# Altium schematic sheet DC_BOOST_PART.SchDoc
size A4
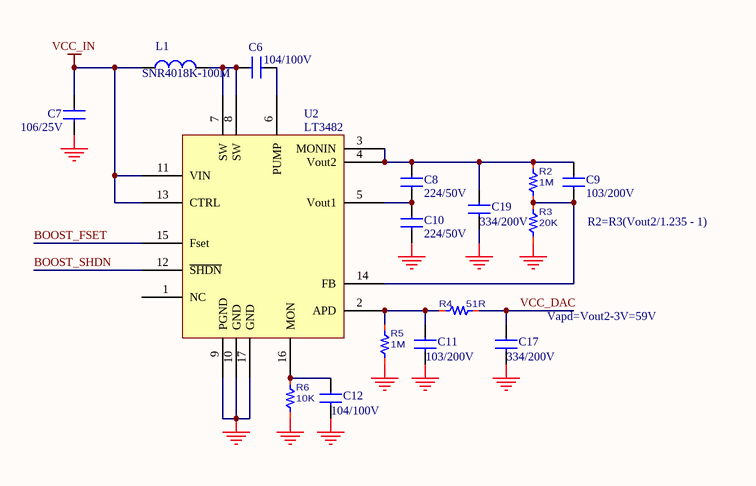
[diagram p0: DC_BOOST_PART.SchDoc]

## Parts
C6  104/100V  [0603C/1]
C7  106/25V  [0603C/1]
C8  224/50V  [0603C/1]
C9  103/200V  [0603C/1]
C10  224/50V  [0603C/1]
C11  103/200V  [0603c/1]
C12  104/100V  [0603c/1]
C17  334/200V  [1210c]
C19  334/200V  [1210c]
L1  SNR4018K-100M  [L3.0-W3.0]
R2  1M  [0603R/1]
R3  20K  [0603R/1]
R4  51R  [0603R/1]
R5  1M  [0603R/1]
R6  10K  [0603R/1]
U2  LT3482  [QFN-16_L3.0-W3.0-P0.50-BL-EP1.7]

## Nets
GND: C7.2 C10.2 C11.2 C12.2 C17.2 C19.2 R3.1 R5.2 R6.1 U2.9(PGND) U2.10(GND) U2.17(GND)
VCC_IN: C7.1 L1.1 U2.11(VIN) U2.13(CTRL)
BOOST_FSET: U2.15(Fset)
BOOST_SHDN: U2.12(~{SHDN})
VCC_DAC: C17.1 R4.1
NetC6_1: C6.1 U2.6(PUMP)
NetC6_2: C6.2 L1.2 U2.7(SW) U2.8(SW)
NetC8_1: C8.1 C9.1 C19.1 R2.2 U2.3(MONIN) U2.4(Vout2)
NetC8_2: C8.2 C10.1 U2.5(Vout1)
NetC9_2: C9.2 R2.1 R3.2 U2.14(FB)
NetC11_1: C11.1 R4.2 R5.1 U2.2(APD)
NetC12_1: C12.1 R6.2 U2.16(MON)

Not connected (* = marked no-connect by the designer): U2 1(NC)

## Notes on the sheet
- (near C9) R2=R3(Vout2/1.235 - 1)
- (near C17) Vapd=Vout2-3V=59V

## Library data of the parts
C6-C12 C17 C19 = 电容: Capacitor
L1 = 电感: Inductor
R2-R6 = RESS1: Resistor